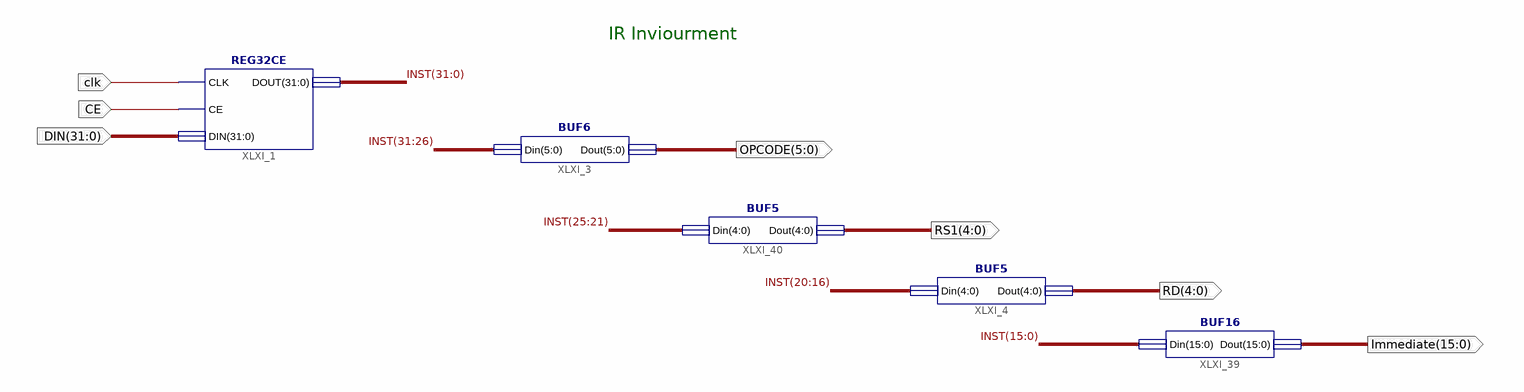
[diagram p0: schematic sheet 1]
// Xilinx ISE schematic IR.sch (spartan6) as structural Verilog: 5 symbols, 7 ports
module IR (
  input  clk,
  input  CE,
  input  [31:0] DIN,
  output [15:0] Immediate,
  output [4:0] RD,
  output [4:0] RS1,
  output [5:0] OPCODE
);

  wire [31:0] INST;

  BUF6 XLXI_3 (.Din(INST[31:26]), .Dout(OPCODE));
  BUF5 XLXI_4 (.Din(INST[20:16]), .Dout(RD));
  REG32CE XLXI_1 (.CLK(clk), .CE(CE), .DIN(DIN), .DOUT(INST));
  BUF16 XLXI_39 (.Din(INST[15:0]), .Dout(Immediate));
  BUF5 XLXI_40 (.Din(INST[25:21]), .Dout(RS1));

  // Notes on the sheet:
  //   IR Inviourment
endmodule
